# EAGLE schematic Blinky (EAGLE 9.2.2)
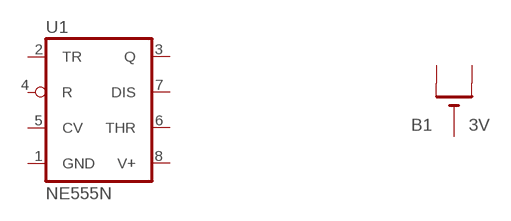
[diagram p0: schematic, sheet 1]

## Parts
B1  3V  CR1220THM  [CR1220-THM]
U1  NE555N  [DIL08]
Unconnected: B1.+1(+) B1.+2(+1) B1.- U1.2(TR) U1.3(Q) U1.4(R) U1.5(CV) U1.6(THR) U1.7(DIS)

## Power pins joined to a net without a drawn wire
GND: U1.1(GND)
V+: U1.8(V+)

## Library data of the parts
B1 = adafruit:CR1220: CR1216/CR1220/CR1225 12mm 3V lithium coin cell Great for battery packup. Both SMT and THM holders. Note the THM package has the ground pads on both sides of the PCB so that the masks are the same - this reduces the cost; SPICEPREFIX: J
U1 = linear:*555: TIMER; SPICEPREFIX: X